# Altium schematic sheet 四轴1004.SchDoc
size A4
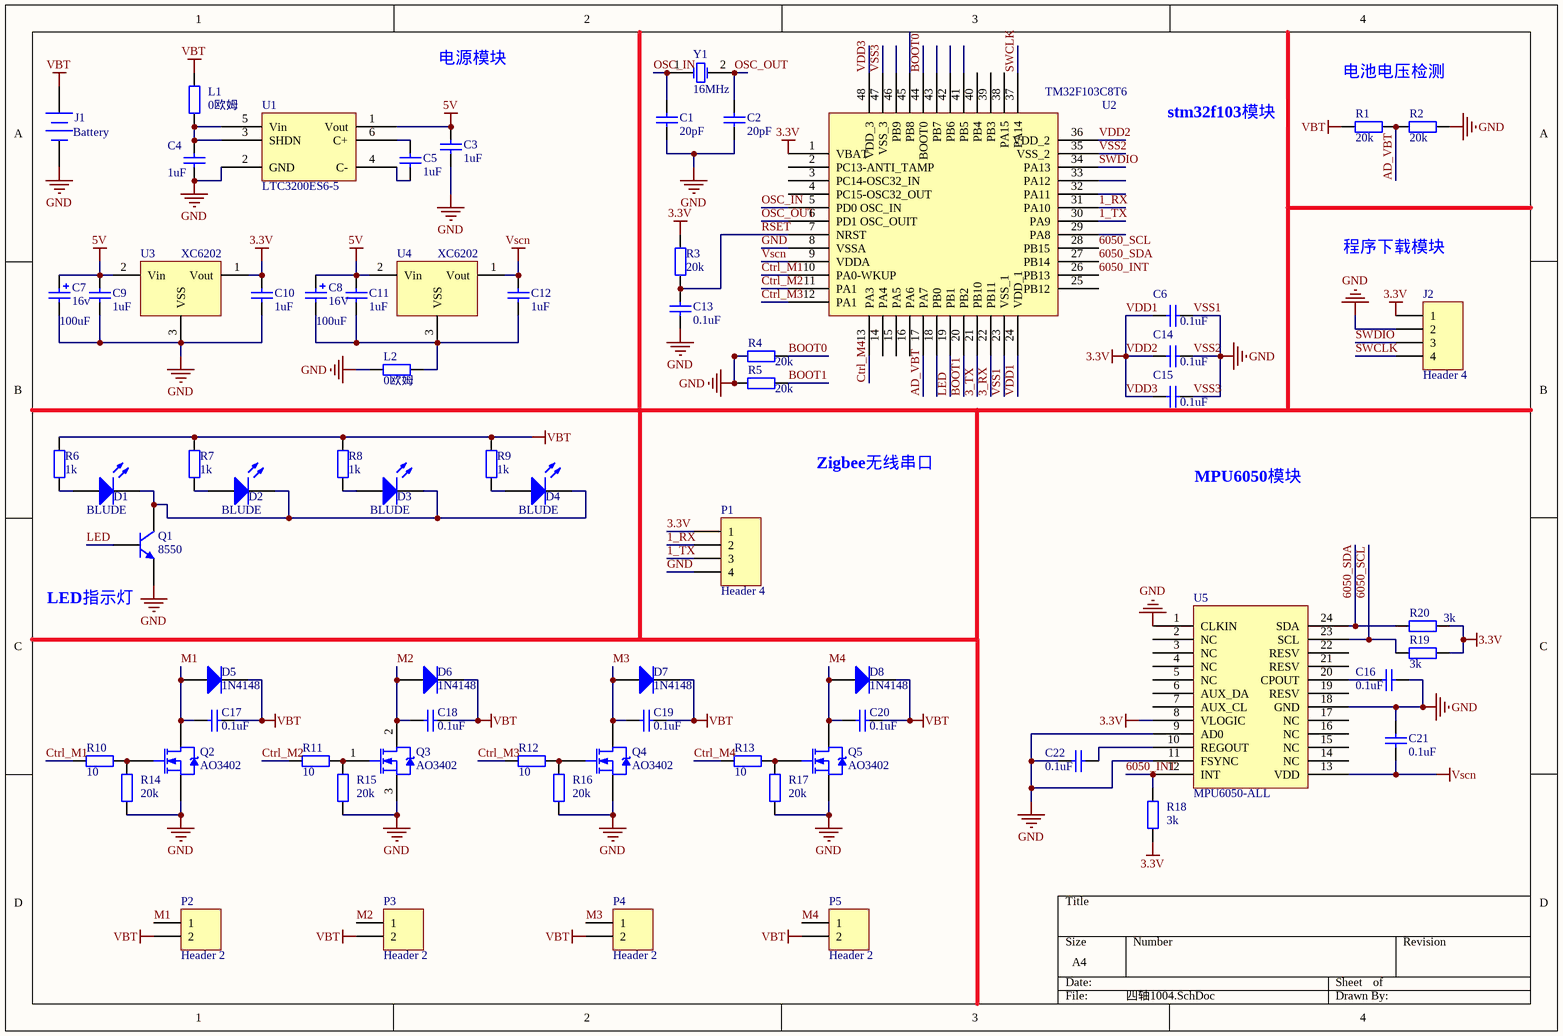
[diagram p0: 四轴1004.SchDoc]

## Parts
C1  value 20pF  [J1-0603]  (hidden comment: Cap)
C2  value 20pF  [J1-0603]  (hidden comment: Cap)
C3  value 1uF  [J1-0603]  (hidden comment: Cap)
C4  value 1uF  [J1-0603]  (hidden comment: Cap)
C5  value 1uF  [J1-0603]  (hidden comment: Cap)
C6  value 0.1uF  [J1-0603]  (hidden comment: Cap)
C7  16v  value 100uF  [6032]
C8  16V  value 100uF  [6032]
C9  value 1uF  [J1-0603]  (hidden comment: Cap)
C10  value 1uF  [J1-0603]  (hidden comment: Cap)
C11  value 1uF  [J1-0603]  (hidden comment: Cap)
C12  value 1uF  [J1-0603]  (hidden comment: Cap)
C13  value 0.1uF  [J1-0603]  (hidden comment: Cap)
C14  value 0.1uF  [J1-0603]  (hidden comment: Cap)
C15  value 0.1uF  [J1-0603]  (hidden comment: Cap)
C16  value 0.1uF  [J1-0603]  (hidden comment: Cap)
C17  value 0.1uF  [J1-0603]  (hidden comment: Cap)
C18  value 0.1uF  [J1-0603]  (hidden comment: Cap)
C19  value 0.1uF  [J1-0603]  (hidden comment: Cap)
C20  value 0.1uF  [J1-0603]  (hidden comment: Cap)
C21  value 0.1uF  [J1-0603]  (hidden comment: Cap)
C22  value 0.1uF  [J1-0603]  (hidden comment: Cap)
D1  BLUDE  [J1-0603]
D2  BLUDE  [J1-0603]
D3  BLUDE  [J1-0603]
D4  BLUDE  [J1-0603]
D5  1N4148  [1206]
D6  1N4148  [1206]
D7  1N4148  [1206]
D8  1N4148  [1206]
J1  Battery  [DIP2-5.08]
J2  Header 4  [HDR1X4]
L1  value 0欧姆  [0805-1]  (hidden comment: Res1)
L2  value 0欧姆  [0805-1]  (hidden comment: Res1)
P1  Header 4  [HDR1X4]
P2  Header 2  [DIP2-1.25]
P3  Header 2  [DIP2-1.25]
P4  Header 2  [DIP2-1.25]
P5  Header 2  [DIP2-1.25]
Q1  8550  [SOT23-8550]
Q2  AO3402  [SOT-23]
Q3  AO3402  [SOT-23]
Q4  AO3402  [SOT-23]
Q5  AO3402  [SOT-23]
R1  value 20k  [J1-0603]  (hidden comment: Res1)
R2  value 20k  [J1-0603]  (hidden comment: Res1)
R3  value 20k  [J1-0603]  (hidden comment: Res1)
R4  value 20k  [J1-0603]  (hidden comment: Res1)
R5  value 20k  [J1-0603]  (hidden comment: Res1)
R6  value 1k  [J1-0603]  (hidden comment: Res1)
R7  value 1k  [J1-0603]  (hidden comment: Res1)
R8  value 1k  [J1-0603]  (hidden comment: Res1)
R9  value 1k  [J1-0603]  (hidden comment: Res1)
R10  value 10  [J1-0603]  (hidden comment: Res1)
R11  value 10  [J1-0603]  (hidden comment: Res1)
R12  value 10  [J1-0603]  (hidden comment: Res1)
R13  value 10  [J1-0603]  (hidden comment: Res1)
R14  value 20k  [J1-0603]  (hidden comment: Res1)
R15  value 20k  [J1-0603]  (hidden comment: Res1)
R16  value 20k  [J1-0603]  (hidden comment: Res1)
R17  value 20k  [J1-0603]  (hidden comment: Res1)
R18  value 3k  [J1-0603]  (hidden comment: Res1)
R19  value 3k  [J1-0603]  (hidden comment: Res1)
R20  value 3k  [J1-0603]  (hidden comment: Res1)
U1  LTC3200ES6-5  [SOT95P245X110-6N]
U2  TM32F103C8T6  [LQFP48]
U3  XC6202  [SOT-23-NO]
U4  XC6202  [SOT-23-NO]
U5  MPU6050-ALL  [QFN50P440X440X80-24N]
Y1  16MHz  [3225--crystal]

## Nets
3.3V: C6.2 C10.2 C14.2 C15.2 J2.1 P1.1 R3.1 R18.1 R19.1 R20.1 U2.1(VBAT) U2.24(VDD_1) U2.36(VDD_2) U2.48(VDD_3) U3.1(Vout) U5.8(VLOGIC)  [also labelled VDD1, VDD2, VDD3]
5V: C3.2 C7.1 C8.1 C9.2 C11.2 U1.1(Vout) U3.2(Vin) U4.2(Vin)
GND: C1.1 C2.1 C3.1 C4.1 C6.1 C7.2 C9.1 C10.1 C13.2 C14.1 C15.1 C16.2 C21.1 C22.2 J1.2(-) J2.2 L2.2 P1.4 Q1.3(E) Q2.3(S) Q3.3(S) Q4.3(S) Q5.3(S) R2.1 R4.1 R5.1 R14.1 R15.1 R16.1 R17.1 U1.2(GND) U2.8(VSSA) U2.23(VSS_1) U2.35(VSS_2) U2.47(VSS_3) U3.3(VSS) U5.1(CLKIN) U5.9(AD0) U5.11(FSYNC) U5.18(GND)  [also labelled VSS1, VSS2, VSS3]
VBT: C17.2 C18.2 C19.2 C20.2 D5.2(K) D6.2(K) D7.2(K) D8.2(K) J1.1(+) L1.2 P2.2 P3.2 P4.2 P5.2 R1.2 R6.2 R7.2 R8.2 R9.2
Vscn: C12.2 C21.2 U2.9(VDDA) U4.1(Vout) U5.13(VDD)
1_RX: P1.2 U2.31(PA10)
1_TX: P1.3 U2.30(PA9)
3_RX: U2.22(PB11)
3_TX: U2.21(PB10)
6050_INT: R18.2 U2.26(PB13) U5.12(INT)
6050_SCL: R19.2 U2.28(PB15) U5.23(SCL)
6050_SDA: R20.2 U2.27(PB14) U5.24(SDA)
AD_VBT: R1.1 R2.2 U2.17(PA7)
BOOT0: R4.2 U2.44(BOOT0)
BOOT1: R5.2 U2.20(PB2)
Ctrl_M1: R10.2 U2.10(PA0-WKUP)
Ctrl_M2: R11.2 U2.11(PA1)
Ctrl_M3: R12.2 U2.12(PA1)
Ctrl_M4: R13.2 U2.13(PA3)
LED: Q1.2(B) U2.19(PB1)
M1: C17.1 D5.1(A) P2.1 Q2.2(D)
M2: C18.1 D6.1(A) P3.1 Q3.2(D)
M3: C19.1 D7.1(A) P4.1 Q4.2(D)
M4: C20.1 D8.1(A) P5.1 Q5.2(D)
OSC_IN: C1.2 U2.5(PD0_OSC_IN) Y1.1(OSC1)
OSC_OUT: C2.2 U2.6(PD1_OSC_OUIT) Y1.2(OSC2)
RSET: C13.1 R3.2 U2.7(NRST)
SWCLK: J2.4 U2.37(PA14)
SWDIO: J2.3 U2.34(PA13)
NetC4_2: C4.2 L1.1 U1.3(SHDN) U1.5(Vin)
NetC5_1: C5.1 U1.4(C-)
NetC5_2: C5.2 U1.6(C+)
NetC8_2: C8.2 C11.1 C12.1 L2.1 U4.3(VSS)
NetC16_1: C16.1 U5.20(CPOUT)
NetC22_1: C22.1 U5.10(REGOUT)
NetD1_1: D1.1(A) R6.1
NetD1_2: D1.2(K) D2.2(K) D3.2(K) D4.2(K) Q1.1(C)
NetD2_1: D2.1(A) R7.1
NetD3_1: D3.1(A) R8.1
NetD4_1: D4.1(A) R9.1
NetQ2_1: Q2.1(G) R10.1 R14.2
NetQ3_1: Q3.1(G) R11.1 R15.2
NetQ4_1: Q4.1(G) R12.1 R16.2
NetQ5_1: Q5.1(G) R13.1 R17.2

Not connected (* = marked no-connect by the designer): U2 2(PC13-ANTI_TAMP) 3(PC14-OSC32_IN) 4(PC15-OSC32_OUT) 14(PA4) 15(PA5) 16(PA6) 18(PB0) 25(PB12) 29(PA8) 32(PA11) 33(PA12) 38(PA15) 39(PB3) 40(PB4) 41(PB5) 42(PB6) 43(PB7) 45(PB8) 46(PB9); U5 2(NC) 3(NC) 4(NC) 5(NC) 6(AUX_DA) 7(AUX_CL) 14(NC) 15(NC) 16(NC) 17(NC) 19(RESV) 21(RESV) 22(RESV)

## Notes on the sheet
- 电源模块
- 电池电压检测
- stm32f103模块
- 程序下载模块
- Zigbee无线串口
- MPU6050模块
- (near Q1) LED指示灯

## Library data of the parts
C1-C6 C9-C22 = Cap: Capacitor; Published: 8-Jun-2000; LatestRevisionDate: 17-Jul-2002; LatestRevisionNote: Re-released for DXP Platform.; PackageReference: RAD-0.3; Publisher: Altium Limited; PackageDescription: Radial Cap, Thru-Hole; 2 Leads; 0.3 in Pin Spacing
C7 C8 = Cap Pol2: Polarized Capacitor (Axial); Published: 8-Jun-2000; LatestRevisionDate: 17-Jul-2002; LatestRevisionNote: Re-released for DXP Platform.; PackageReference: POLAR0.8; Publisher: Altium Limited; PackageDescription: Polarized Capacitor; 2 Leads
D1-D4 = LED0: Typical INFRARED GaAs LED; Published: 8-Jun-2000; LatestRevisionDate: 08-Jul-2005; LatestRevisionNote: Mech Layer 1 removed.; PackageReference: LED-0; Publisher: Altium Limited; PackageDescription: LED; 2 Leads
D5-D8 = Diode 1N4148: High Conductance Fast Diode; Published: 8-Jun-2000; LatestRevisionDate: 17-Jul-2002; LatestRevisionNote: Re-released for DXP Platform.; DatasheetVersion: 1997; PackageReference: DO-35; Publisher: Altium Limited; PackageDescription: Diode, Axial; Body 3.8 x 1.9 mm (LxDia. max), Lead Dia. 0.53 mm (max); Code_JEDEC: DO-204-AH; ComponentLink1Description: Manufacturer Link; ComponentLink1URL: http://www.fairchildsemi.com/; ComponentLink2Description: Datasheet; ComponentLink2URL: http://www.fairchildsemi.com/ds/1N%2F1N4148.pdf
J1 = Battery: Multicell Battery; Published: 24-Mar-1999; LatestRevisionDate: 17-Jul-2002; LatestRevisionNote: Re-released for DXP Platform.; PackageReference: BAT-2; Publisher: Altium Limited; PackageDescription: Battery; 2 Leads
J2 P1 = Header 4: Header, 4-Pin; LatestRevisionDate: 17-Jul-2002; LatestRevisionNote: Re-released for DXP Platform.; Publisher: Altium Limited
L1 L2 R1-R20 = Res1: 贴片电阻; Published: 8-Jun-2000; LatestRevisionDate: 17-Jul-2002; LatestRevisionNote: Re-released for DXP Platform.; PackageReference: AXIAL-0.4; Publisher: Altium Limited
P2-P5 = Header 2: Header, 2-Pin; LatestRevisionDate: 17-Jul-2002; LatestRevisionNote: Re-released for DXP Platform.; Publisher: Altium Limited
Q1 = QNPN: NPN Bipolar Transistor; Published: 8-Jun-2000; LatestRevisionDate: 29-May-2009; LatestRevisionNote: IPC-7351 Footprint Added.; PackageVersion: Aug-1999; PackageReference: SOT-23B; Publisher: Altium Limited; PackageDescription: 3-Pin SOT-23 Package 0.95 mm Pitch, 2.4 mm Lead Span
Q2-Q5 = NMOS-2: N-Channel Power MOSFET; Note: Pin 2 is electrically connected to pin 4.; Published: 8-Jun-2000; LatestRevisionDate: 17-Jul-2002; LatestRevisionNote: Re-released for DXP Platform.; DatasheetVersion: PD-9.814; PackageVersion: Feb-1997; PackageReference: TO-220AB; Publisher: Altium Limited; PackageDescription: TO, Thru-Hole, Vertical, Heatsink Mounted; 3 In-Line Leads; Pitch 2.54 mm; ComponentLink1Description: Manufacturer Link; ComponentLink1URL: http://www.irf.com/
U2 = LQFP48-STM32F103C8T6
Y1 = XTAL: Crystal Oscillator; Published: 8-Jun-2000; LatestRevisionDate: 17-Jul-2002; LatestRevisionNote: Re-released for DXP Platform.; PackageReference: R38; Publisher: Altium Limited; PackageDescription: Crystal, Thru-Hole; 2 Leads; Body 3.1 x 8.2 mm (Dia.xH)